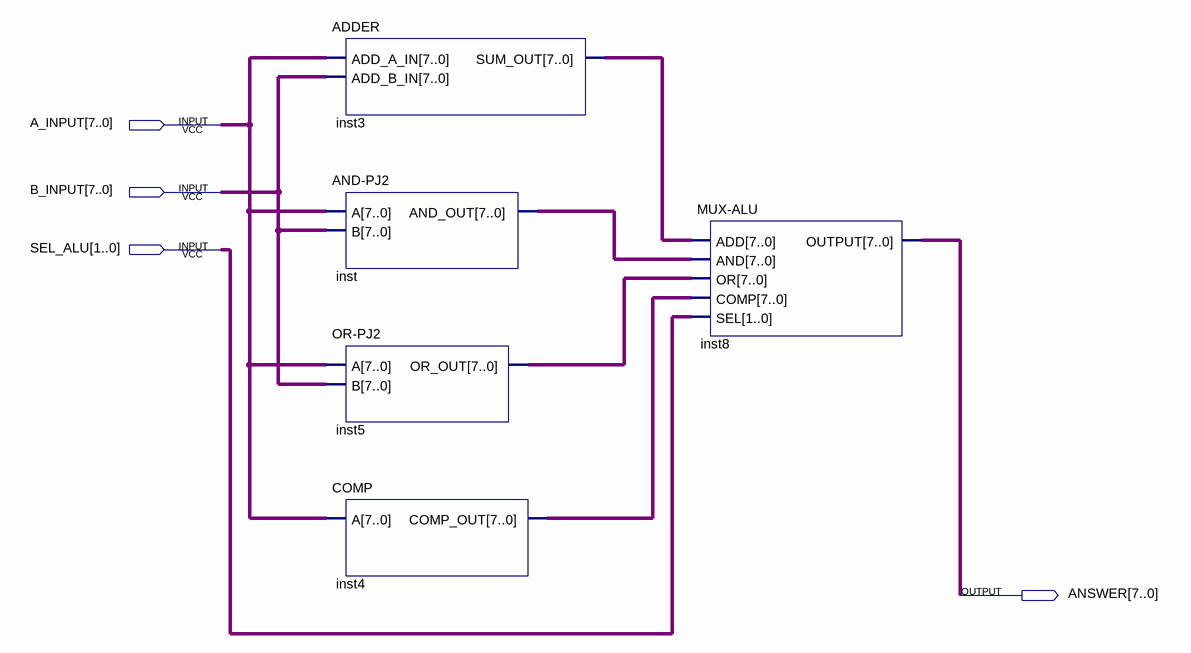
[diagram p0: schematic sheet]
// Quartus schematic 8-bit-ALU.bdf as structural Verilog: 5 symbols, 4 pins
module \8-bit-ALU  (
  input  [7:0] A_INPUT,
  input  [7:0] B_INPUT,
  input  [1:0] SEL_ALU,
  output [7:0] ANSWER
);

  wire [7:0] inst3_sum_out, inst4_comp_out, inst5_or_out, inst_and_out;

  ADDER inst3 (.ADD_A_IN(A_INPUT), .ADD_B_IN(B_INPUT), .SUM_OUT(inst3_sum_out));
  \AND-PJ2  inst (.A(A_INPUT), .B(B_INPUT), .AND_OUT(inst_and_out));
  \OR-PJ2  inst5 (.A(A_INPUT), .B(B_INPUT), .OR_OUT(inst5_or_out));
  COMP inst4 (.A(A_INPUT), .COMP_OUT(inst4_comp_out));
  \MUX-ALU  inst8 (
    .ADD(inst3_sum_out), .AND(inst_and_out), .OR(inst5_or_out), .COMP(inst4_comp_out), .SEL(SEL_ALU),
    .OUTPUT(ANSWER));
endmodule
